# EAGLE schematic ospi143 (EAGLE 7.7.0)
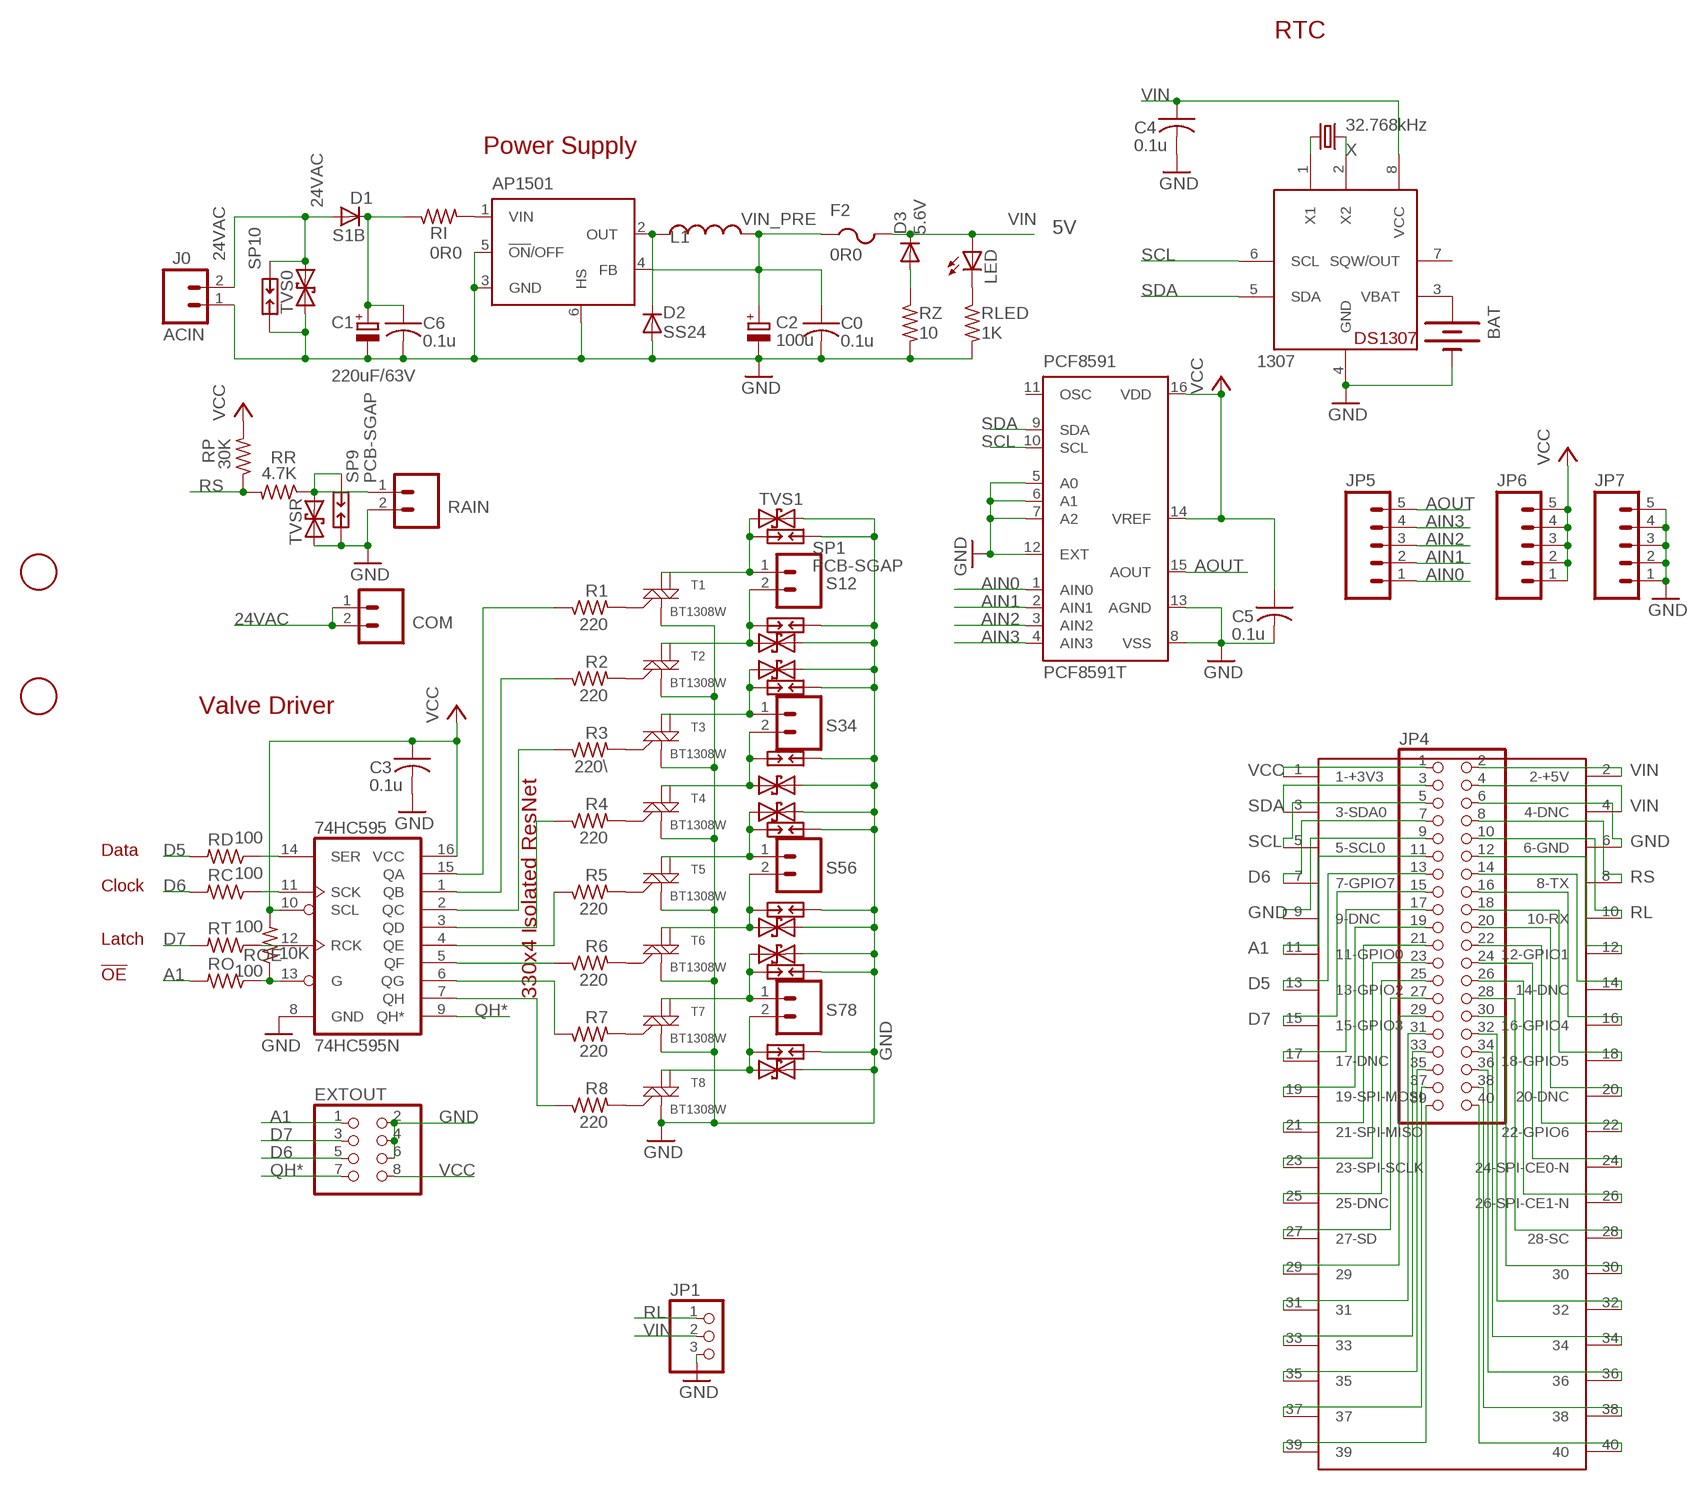
[diagram p0: schematic, sheet 1]

## Parts
74HC595  74HC595N  74LS595D  [SO16]
1307  DS1307  DS1307SOIC  [SO08]
AP1501  LM2596S  [TO263-5]
BAT  BATTERYBATTERY_12MM_SMT  [BATTCON_12MM_SMT]
C0  0.1u  C-USC0603K  [C0603K]
C1  220uF/63V  CPOL-EUE  [PANASONIC_E]
C2  100u  CPOL-EUE  [PANASONIC_E]
C3  0.1u  C-USC0603K  [C0603K]
C4  0.1u  C-USC0603K  [C0603K]
C5  0.1u  C-USC0603K  [C0603K]
C6  0.1u  C-USC0603K  [C0603K]
COM  M025MM-X  [SCREWTERMINAL-5MM-2-X]
D1  S1B  DIODE-DO-214AC  [DO-214AC]
D2  SS24  DIODE-SMB  [SMB]
D3  5.6V  DIODE-MINIMELF  [MINIMELF]
EXTOUT  PINHD-2X4/90  [2X04/90]
F2  0R0  PTCFUSE-1812  [1812]
J0  ACIN  M024MM-X  [SCREWTERMINAL-4MM-2-X]
JP1  PINHD-1X3  [1X03]
JP4  PINHD-2X20  [2X20]
JP5  M05PTH  [1X05]
JP6  M05PTH  [1X05]
JP7  M05PTH  [1X05]
L1  150uH  INDUCTORPWR  [CDRH125]
LED  LEDCHIPLED_0805  [CHIPLED_0805]
PCF8591  PCF8591T  [SO16W]
R1  220  R-US_R0603  [R0603]
R2  220  R-US_R0603  [R0603]
R3  220\  R-US_R0603  [R0603]
R4  220  R-US_R0603  [R0603]
R5  220  R-US_R0603  [R0603]
R6  220  R-US_R0603  [R0603]
R7  220  R-US_R0603  [R0603]
R8  220  R-US_R0603  [R0603]
RAIN  M025MM-X  [SCREWTERMINAL-5MM-2-X]
RC  100  R-US_R0603  [R0603]
RD  100  R-US_R0603  [R0603]
RI  0R0  R-US_R2010  [R2010]
RLED  1K  R-US_R0805  [R0805]
RO  100  R-US_R0603  [R0603]
ROE  10K  R-US_R0603  [R0603]
RP  30K  R-US_R0805  [R0805]
RR  4.7K  R-US_R0805  [R0805]
RT  100  R-US_R0603  [R0603]
RZ  10  R-US_R2010  [R2010]
S12  M025MM-X  [SCREWTERMINAL-5MM-2-X]
S34  M025MM-X  [SCREWTERMINAL-5MM-2-X]
S56  M025MM-X  [SCREWTERMINAL-5MM-2-X]
S78  M025MM-X  [SCREWTERMINAL-5MM-2-X]
SP1  PCB-SGAP  [PCB-SGAP]
SP2  PCB-SGAP  [PCB-SGAP]
SP3  PCB-SGAP  [PCB-SGAP]
SP4  PCB-SGAP  [PCB-SGAP]
SP5  PCB-SGAP  [PCB-SGAP]
SP6  PCB-SGAP  [PCB-SGAP]
SP7  PCB-SGAP  [PCB-SGAP]
SP8  PCB-SGAP  [PCB-SGAP]
SP9  PCB-SGAP  [PCB-SGAP]
SP10  PCB-SGAP  [PCB-SGAP]
T1  BT1308W  MAC97SOT223  [SOT223]
T2  BT1308W  MAC97SOT223  [SOT223]
T3  BT1308W  MAC97SOT223  [SOT223]
T4  BT1308W  MAC97SOT223  [SOT223]
T5  BT1308W  MAC97SOT223  [SOT223]
T6  BT1308W  MAC97SOT223  [SOT223]
T7  BT1308W  MAC97SOT223  [SOT223]
T8  BT1308W  MAC97SOT223  [SOT223]
TVS0  TVSSMB  [SMB]
TVS1  TVSSMB  [SMB]
TVS2  TVSSMB  [SMB]
TVS3  TVSSMB  [SMB]
TVS4  TVSSMB  [SMB]
TVS5  TVSSMB  [SMB]
TVS6  TVSSMB  [SMB]
TVS7  TVSSMB  [SMB]
TVS8  TVSSMB  [SMB]
TVSR  TVSSMB  [SMB]
U$1  FIDUCIAL  [FIDUCIAL_1MM]
U$2  RPIB+  [RPIB+]
U$3  FIDUCIAL  [FIDUCIAL_1MM]
X  32.768kHz  CRYSTALMM20SS  [MM20SS]

## Nets
24VAC [power]: COM.1 COM.2 D1.A J0.2 SP10.1 TVS0.C
A1: EXTOUT.1 JP4.11 RO.2 U$2.11(11-GPIO0)
AIN0: JP5.1 PCF8591.1(AIN0)
AIN1: JP5.2 PCF8591.2(AIN1)
AIN2: JP5.3 PCF8591.3(AIN2)
AIN3: JP5.4 PCF8591.4(AIN3)
AOUT: JP5.5 PCF8591.15(AOUT)
D5: JP4.13 RD.2 U$2.13(13-GPIO2)
D6: EXTOUT.5 JP4.7 RC.2 U$2.7(7-GPIO7)
D7: EXTOUT.3 JP4.15 RT.2 U$2.15(15-GPIO3)
GND [power]: 74HC595.8(GND) 1307.4(GND) AP1501.3(GND) AP1501.5(!ON!/OFF) AP1501.6(HS) BAT.P$1(-) C0.2 C1.- C2.- C3.2 C4.2 C5.2 C6.2 D2.A EXTOUT.2 EXTOUT.4 EXTOUT.6 J0.1 JP1.3 JP4.6 JP4.9 JP7.1 JP7.2 JP7.3 JP7.4 JP7.5 PCF8591.5(A0) PCF8591.6(A1) PCF8591.7(A2) PCF8591.8(VSS) PCF8591.12(EXT) PCF8591.13(AGND) RAIN.2 RLED.2 RZ.2 SP1.1 SP2.1 SP3.1 SP4.1 SP5.1 SP6.1 SP7.1 SP8.1 SP9.2 SP10.2 T1.1(M1) T2.1(M1) T3.1(M1) T4.1(M1) T5.1(M1) T6.1(M1) T7.1(M1) T8.1(M1) TVS0.A TVS1.C TVS2.C TVS3.C TVS4.C TVS5.C TVS6.C TVS7.C TVS8.C TVSR.A U$2.6(6-GND) U$2.9(9-DNC)
N$1: LED.C RLED.1
N$2 [power]: C1.+ C6.1 D1.C RI.1
N$3: R1.2 T1.3(G)
N$4: 74HC595.5(QF) R6.1
N$5: 74HC595.6(QG) R7.1
N$6: D3.A RZ.1
N$7: 74HC595.7(QH) R8.1
N$8 [power]: AP1501.2(OUT) D2.C L1.1
N$9: 1307.2(X2) X.4
N$10: 74HC595.4(QE) R5.1
N$11: 74HC595.3(QD) R4.1
N$12: 74HC595.2(QC) R3.1
N$13: 74HC595.1(QB) R2.1
N$14: 74HC595.15(QA) R1.1
N$15: R2.2 T2.3(G)
N$16 [power]: S12.1 SP1.2 T1.2(M2) TVS1.A
N$17 [power]: S12.2 SP2.2 T2.2(M2) TVS2.A
N$18 [power]: S34.1 SP3.2 T3.2(M2) TVS3.A
N$19: R3.2 T3.3(G)
N$20 [power]: S34.2 SP4.2 T4.2(M2) TVS4.A
N$21: R4.2 T4.3(G)
N$22 [power]: S56.1 SP5.2 T5.2(M2) TVS5.A
N$23 [power]: S56.2 SP6.2 T6.2(M2) TVS6.A
N$24 [power]: S78.1 SP7.2 T7.2(M2) TVS7.A
N$25 [power]: S78.2 SP8.2 T8.2(M2) TVS8.A
N$26: R5.2 T5.3(G)
N$27: R6.2 T6.3(G)
N$28: R7.2 T7.3(G)
N$29: R8.2 T8.3(G)
N$30: 1307.1(X1) X.1
N$31: RAIN.1 RR.1 SP9.1 TVSR.C
N$33: 74HC595.14(SER) RD.1
N$34: 74HC595.11(SCK) RC.1
N$35: 74HC595.12(RCK) RT.1
N$36: 1307.3(VBAT) BAT.P$2(+)
N$37: JP4.12 U$2.12(12-GPIO1)
N$38: JP4.14 U$2.14(14-DNC)
N$39: JP4.16 U$2.16(16-GPIO4)
N$40: 74HC595.13(G) RO.1 ROE.1
N$41: JP4.23 U$2.23(23-SPI-SCLK)
N$42: JP4.25 U$2.25(25-DNC)
N$43: JP4.27 U$2.27(27-SD)
N$44: JP4.29 U$2.29
N$45: JP4.39 U$2.39
N$46: JP4.37 U$2.37
N$47: JP4.17 U$2.17(17-DNC)
N$48: JP4.19 U$2.19(19-SPI-MOSI)
N$49: JP4.21 U$2.21(21-SPI-MISO)
N$50: JP4.35 U$2.35
N$51: JP4.33 U$2.33
N$52: JP4.31 U$2.31
N$53: JP4.34 U$2.34
N$54: JP4.36 U$2.36
N$55: JP4.38 U$2.38
N$56: JP4.40 U$2.40
N$57: AP1501.1(VIN) RI.2
N$59: JP4.18 U$2.18(18-GPIO5)
N$60: JP4.20 U$2.20(20-DNC)
N$61: JP4.22 U$2.22(22-GPIO6)
N$62: JP4.24 U$2.24(24-SPI-CE0-N)
N$63: JP4.26 U$2.26(26-SPI-CE1-N)
N$64: JP4.28 U$2.28(28-SC)
N$65: JP4.30 U$2.30
N$66: JP4.32 U$2.32
QH*: 74HC595.9(QH*) EXTOUT.7
RL: JP1.1 JP4.10 U$2.10(10-RX)
RS: JP4.8 RP.1 RR.2 U$2.8(8-TX)
SCL: 1307.6(SCL) JP4.5 PCF8591.10(SCL) U$2.5(5-SCL0)
SDA: 1307.5(SDA) JP4.3 PCF8591.9(SDA) U$2.3(3-SDA0)
VCC: 74HC595.10(SCL) 74HC595.16(VCC) C3.1 C5.1 EXTOUT.8 JP4.1 JP6.1 JP6.2 JP6.3 JP6.4 JP6.5 PCF8591.14(VREF) PCF8591.16(VDD) ROE.2 RP.2 U$2.1(1-+3V3)
VIN [power]: 1307.8(VCC) C4.1 D3.C F2.2 JP1.2 JP4.2 JP4.4 LED.A U$2.2(2-+5V) U$2.4(4-DNC)
VIN_PRE [power]: AP1501.4(FB) C0.1 C2.+ F2.1 L1.2
Unconnected: 1307.7(SQW/OUT) PCF8591.11(OSC) T1.4(M2-4) T2.4(M2-4) T3.4(M2-4) T4.4(M2-4) T5.4(M2-4) T6.4(M2-4) T7.4(M2-4) T8.4(M2-4)

## Notes on the sheet
- RTC
- Power Supply
- 5V
- Valve Driver
- Data
- Clock
- Latch
- !OE
- 330x4 Isolated ResNet

## Library data of the parts
74HC595 = SparkFun:74*595: 8-bit SHIFT REGISTER, output latch
1307 = adafruit:DS1307: DS1307 Real time clock (RTC) with battery backup ability. Talk to it via i2c
AP1501 = national-semiconductor:LM2596: SIMPLE SWITCHER® Power Converter 150 kHz 3A Step-Down Voltage Regulator Source: http://www.national.com/ds/LM/LM2596.pdf; MF: NATIONAL SEMICONDUCTOR; MPN: LM2596S-ADJ/NOPB; OC_FARNELL: 9494367; OC_NEWARK: 41K3842
BAT = SparkFunNew:BATTERY: Battery Holders Various common sizes : AA, AAA, 20mm coin cell and 12mm coin cell.
C0 C3-C6 = adafruit:C-US: CAPACITOR, American symbol
C1 C2 = resistor:CPOL-EU: POLARIZED CAPACITOR, European symbol
COM J0 RAIN S12 S34 S56 S78 = SparkFun:M02: Header 2 Standard 2-pin 0.1" header. Use with straight break away headers (SKU : PRT-00116), right angle break away headers (PRT-00553), swiss pins (PRT-00743), machine pins (PRT-00117), and female headers (PRT-00115). Molex polarized connector foot print use with SKU : PRT-08233 with associated crimp pins and housings.
D1-D3 = diode:DIODE-: DIODE
EXTOUT = pinhead:PINHD-2X4: PIN HEADER
F2 = adafruit:PTCFUSE: PTC fuses, resettable thermistors
JP1 = pinhead:PINHD-1X3: PIN HEADER
JP4 = adafruit_3:PINHD-2X20: PIN HEADER
JP5-JP7 = SparkFun:M05: Header 5 Standard 5-pin 0.1" header. Use with straight break away headers (SKU : PRT-00116), right angle break away headers (PRT-00553), swiss pins (PRT-00743), machine pins (PRT-00117), and female headers (PRT-00115). Molex polarized connector foot print use with SKU : PRT-08230 with associated crimp pins and housings.
L1 = SparkFunNew:INDUCTOR: Inductors Basic Inductor/Choke - 0603 and 1206. Footprints are not proven and vary greatly between part numbers.
LED = adafruit:LED: LED OSRAM: - CHIPLED LG R971, LG N971, LY N971, LG Q971, LY Q971, LO R971, LY R971 LH N974, LH R974 LS Q976, LO Q976, LY Q976 LO Q996 - Hyper CHIPLED LW Q18S LB Q993, LB Q99A, LB R99A - SideLED LS A670, LO A670, LY A670, LG A670, LP A670 LB A673, LV A673, LT A673, LW A673 LH A674 LY A675 LS A676, LA A676, LO A676, LY A676, LW A676 LS A679, LY A679, LG A679 - Hyper Micro SIDELED® LS Y876, LA Y876, LO Y876, LY Y876 LT Y87S - SmartLED LW L88C, LW L88S LB L89C, LB L89S, LG L890 LS L89K, LO L89K, LY L89K LS L896, LA L896, LO L896, LY L896 - TOPLED LS T670, LO T670, LY T670, LG T670, LP T670 LSG T670, LSP T670, LSY T670, LOP T670, LYG T670 LG T671, LOG T671, LSG T671 LB T673, LV T673, LT T673, LW T673 LH T674 LS T676, LA T676, LO T676, LY T676, LB T676, LH T676, LSB T676, LW T676 LB T67C, LV T67C, LT T67C, LS T67K, LO T67K, LY T67K, LW E67C LS E67B, LA E67B, LO E67B, LY E67B, LB E67C, LV E67C, LT E67C LW T67C LS T679, LY T679, LG T679 LS T770, LO T770, LY T770, LG T770, LP T770 LB T773, LV T773, LT T773, LW T773 LH T774 LS E675, LA E675, LY E675, LS T675 LS T776, LA T776, LO T776, LY T776, LB T776 LHGB T686 LT T68C, LB T68C - Hyper Mini TOPLED® LB M676 - Mini TOPLED Santana® LG M470 LS M47K, LO M47K, LY M47K Source: http://www.osram.convergy.de/
PCF8591 = micro-philips:PCF8591: I2C-Bus D/A CONVERTER; MPN: PCF8591T/2,512; OC_FARNELL: 1826767; OC_NEWARK: 70R6911
R1-R8 RC RD RLED RO ROE RP RR RT RZ = adafruit2013:R-US_: RESISTOR, American symbol
RI = adafruitGood:R-US_: RESISTOR, American symbol
SP1-SP10 = varistor:PCB-SGAP
T1-T8 = SparkFun:MAC97: MAC97 Triac http://www.onsemi.com/pub_link/Collateral/MAC97-D.PDF
TVS0 TVS1-TVS8 TVSR = SparkFunNew:TVS
U$1 U$3 = adafruitGood:FIDUCIAL: For use by pick and place machines to calibrate the vision/machine, 1mm By microbuilder.eu
U$2 = RaspberryPi:RPIB+
X = crystal:CRYSTAL: CRYSTAL; OC_FARNELL: unknown; OC_NEWARK: unknown

## Net classes
0 default: width 0.178 mm, clearance 0.178 mm
1 power: width 0.406 mm, clearance 0.203 mm
2 relay power: width 0.508 mm, clearance 0.305 mm